# Altium schematic sheet OutputStage.SchDoc
size A3; Organization: MCI; SheetNumber: 1; SheetTotal: 1
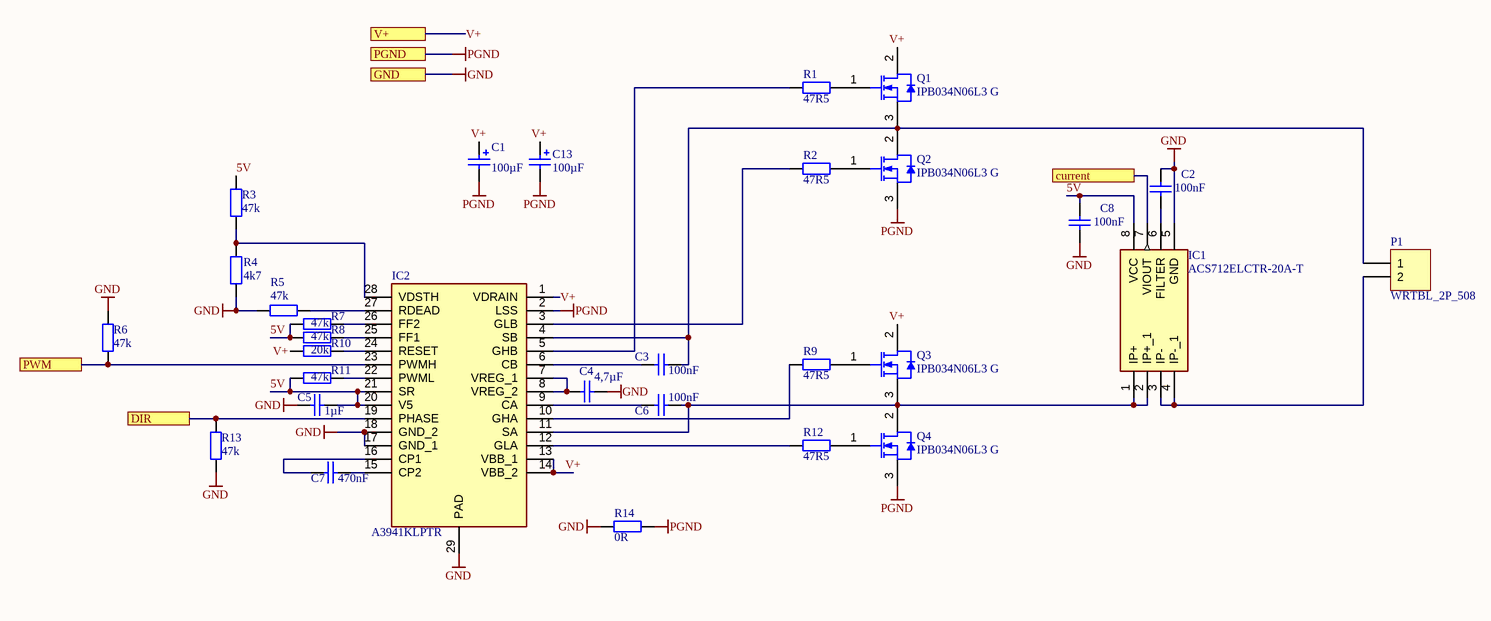
[diagram p0: OutputStage.SchDoc]

## Parts
C1  100µF  [Cap_THT_Elko_rad_D8mm]
C2  100nF  [_0603]
C3  100nF  [_0603]
C4  4,7µF  [_0603]
C5  1µF  [_0805]
C6  100nF  [_0603]
C7  470nF  [_0603]
C8  100nF  [_0603]
C13  100µF  [Cap_THT_Elko_rad_D8mm]
IC1  ACS712ELCTR-20A-T  [SOIC127P600X175-8N]
IC2  A3941KLPTR  [SOP65P640X120-29N]
P1  WRTBL_2P_508  [WRTBL_2P_508]
Q1  IPB034N06L3 G  [INF-PG-TO-263-3-2_A_N]
Q2  IPB034N06L3 G  [INF-PG-TO-263-3-2_A_N]
Q3  IPB034N06L3 G  [INF-PG-TO-263-3-2_A_N]
Q4  IPB034N06L3 G  [INF-PG-TO-263-3-2_A_N]
R1  47R5  [_0603]
R2  47R5  [_0603]
R3  47k  [_0603]
R4  4k7  [_0603]
R5  47k  [_0603]
R6  47k  [_0603]
R7  47k  [_0603]
R8  47k  [_0603]
R9  47R5  [_0603]
R10  20k  [_0603]
R11  47k  [_0603]
R12  47R5  [_0603]
R13  47k  [_0603]
R14  0R  [_0603]

## Ports
current, DIR, GND, PGND, PWM, V+

## Nets
GND: C2.2 C4.2 C5.1 C8.1 IC1.5(GND) IC2.17(GND_1) IC2.18(GND_2) IC2.29(PAD) R4.2 R5.2 R6.1 R13.2 R14.2 ; port GND
PGND: C1.2 C13.2 IC2.2(LSS) Q2.3(SOURCE) Q4.3(SOURCE) R14.1 ; port PGND
5V: C5.2 C8.2 IC1.8(VCC) IC2.20(V5) IC2.21(SR) R3.1 R7.2 R8.2 R11.2
current: IC1.7(VIOUT) ; port current
DIR: IC2.19(PHASE) R13.1 ; port DIR
PWM: IC2.23(PWMH) R6.2 ; port PWM
V+: C1.1 C13.1 IC2.1(VDRAIN) IC2.13(VBB_1) IC2.14(VBB_2) Q1.2(DRAIN) Q3.2(DRAIN) R10.2 ; port V+
NetC2_1: C2.1 IC1.6(FILTER)
NetC3_1: C3.1 IC2.6(CB)
NetC3_2: C3.2 IC2.4(SB) P1.1 Q1.3(SOURCE) Q2.2(DRAIN)
NetC4_1: C4.1 IC2.7(VREG_1) IC2.8(VREG_2)
NetC6_1: C6.1 IC2.9(CA)
NetC6_2: C6.2 IC1.1(IP+) IC1.2(IP+_1) IC2.11(SA) Q3.3(SOURCE) Q4.2(DRAIN)
NetC7_1: C7.1 IC2.16(CP1)
NetC7_2: C7.2 IC2.15(CP2)
NetIC1_3: IC1.3(IP-) IC1.4(IP-_1) P1.2
NetIC2_3: IC2.3(GLB) R2.2
NetIC2_5: IC2.5(GHB) R1.2
NetIC2_10: IC2.10(GHA) R9.2
NetIC2_12: IC2.12(GLA) R12.2
NetIC2_22: IC2.22(PWML) R11.1
NetIC2_24: IC2.24(RESET) R10.1
NetIC2_25: IC2.25(FF1) R8.1
NetIC2_26: IC2.26(FF2) R7.1
NetIC2_27: IC2.27(RDEAD) R5.1
NetIC2_28: IC2.28(VDSTH) R3.2 R4.1
NetQ1_1: Q1.1(GATE) R1.1
NetQ2_1: Q2.1(GATE) R2.1
NetQ3_1: Q3.1(GATE) R9.1
NetQ4_1: Q4.1(GATE) R12.1

## Notes on the sheet
- Project
- Date:
- Drawn by:
- Time:
- Number:
- Revision:
- Sheet
- of
- ELECTRONICS
- File:

## Library data of the parts
C1 C13 = Cap_15: Name: Cap_Elko_rad_100u_35V; RS_number: 228-6767; QR: 1; ax_rad: rad; Capacity: 100u; Voltage: 35V; UID: Cap_15; Name_Hyperlink: Elko 100µF 35VDC; ComponentLink1URL: http://de.rs-online.com/web/search/searchBrowseAction.html?method=getProduct&R=2286767; mounting: THT
C2-C4 C6-C8 = Cap_129: Name: Cap_0603; QR: 0; UID: Cap_129; mounting: SMD
C5 = Cap_128: Name: Cap_0805; QR: 0; UID: Cap_128; ComponentLink1URL: #VALUE!; mounting: SMD
IC1 = ACS712ELCTR-20A-T: Integrated Circuit; Manufacturer_Name: Allegro Microsystems; Allied_Number: R1076682; Datasheet Link: http://uk.rs-online.com/web/p/products/6807135P; Height: 1.75mm; RS Part Number: 6807135P; RS Price/Stock: http://uk.rs-online.com/web/p/products/6807135P; Manufacturer_Part_Number: ACS712ELCTR-20A-T
IC2 = A3941KLPTR: Integrated Circuit; Manufacturer_Name: Allegro Microsystems; Datasheet Link: http://uk.rs-online.com/web/p/products/7248704; Height: 1.2mm; Manufacturer_Part_Number: A3941KLPTR; RS Part Number: 7248704P; RS Price/Stock: http://uk.rs-online.com/web/p/products/7248704P
P1 = Con_7: RS_number: 193-0586; QR: 0; UID: Con_7; Name: WRTBL_2P_508; Name_Hyperlink: Printklemme 5,08mm 2-polig; ComponentLink1URL: http://at.rs-online.com/web/search/searchBrowseAction.html?method=getProduct&R=1930586; mounting: THT; Pins: 2
Q1-Q4 = IPB034N06L3 G: N-Channel OptiMOS 3 Power-Transistor, 60 V VDS, 90 A ID, -55 to 175 degC, PG-TO-263-3-2, Reel, Green; Manufacturer: Infineon; Green: TRUE; ID (max): 90 A; IDpuls (max): 360 A; Polarity: N; Ptot (max): 167 W; QG: 59 nC; RDS (on) (max): 3.7 mOhm; RDS (on) (max) (@4.5V): 5.7 mOhm; Rth: 0.9 K/W; RthJA (max): 62 K/W; VDS (max): 60 V; VGS(th) (max): 2.2 V; VGS(th) (min): 1.2 V; DatasheetVersion: Rev. 2.7; PackageVersion: Rev. 01, 08/2007; PackageReference: PG-TO-263-3-2; PackageDescription: 3-Pin Plastic (Green) Transistor Single Outline Package, 10.06 x 8.98 mm Body, 2.54 mm Pitch; Supplier 1: Digi-Key; Supplier Part Number 1: IPB034N06L3 GTR-ND; Supplier 2: Digi-Key; Supplier Part Number 2: IPB034N06L3 GCT-ND; Supplier 3: Digi-Key; Supplier Part Number 3: IPB034N06L3 GDKR-ND; Supplier 4: Mouser; Supplier Part Number 4: 726-IPB034N06L3G; Halogen-free: TRUE; Packing: Reel; RthJC (max): 0.9 K/W; Mounting Technology: Surface Mount; PartNumber: IPB034N06L3 G; ComponentLink1Description: Manufacturer URL; ComponentLink1URL: http://www.infineon.com/; ComponentLink2Description: Datasheet; ComponentLink2URL: http://www.infineon.com/dgdl/IPP037N06L3_Rev2.7.pdf?folderId=db3a304313b8b5a60113cee8763b02d7&fileId=db3a30431b3e89eb011b4561341f7d38; ComponentLink3Description: Package Specification; ComponentLink3URL: http://www.infineon.com/dgdl/IPB026N06N_Rev2.2.pdf?folderId=db3a304313b8b5a60113cee8763b02d7&fileId=db3a3043372d5cc8013754c7b2a74f7c
R1-R14 = Res_5: Name: Res_0603; UID: Res_5; mounting: SMD